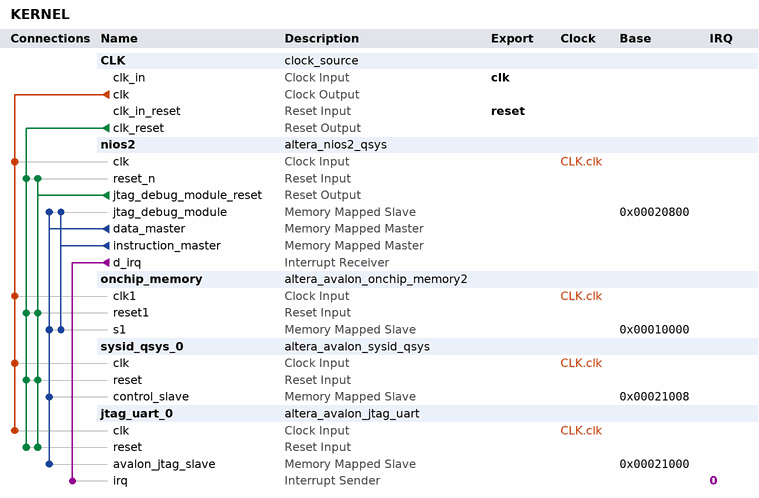
[diagram p0: system contents]
# Platform Designer (Qsys) system KERNEL, Cyclone IV E EP4CE15F17C8
# Parameters at their usual value, and those the tool derives, are not listed.
package require -exact qsys 12.1
create_system KERNEL
set_project_property DEVICE_FAMILY {Cyclone IV E}
set_project_property DEVICE EP4CE15F17C8

add_instance CLK clock_source 12.1
set_instance_parameter_value CLK clockFrequency 100000000

add_instance nios2 altera_nios2_qsys 12.1
set_instance_parameter_value nios2 resetSlave onchip_memory.s1
set_instance_parameter_value nios2 exceptionSlave onchip_memory.s1
set_instance_parameter_value nios2 breakSlave nios2.jtag_debug_module
set_instance_parameter_value nios2 impl Fast
set_instance_parameter_value nios2 icache_size 4096

add_instance onchip_memory altera_avalon_onchip_memory2 12.1
set_instance_parameter_value onchip_memory dataWidth 32
set_instance_parameter_value onchip_memory dualPort false
set_instance_parameter_value onchip_memory initMemContent true
set_instance_parameter_value onchip_memory initializationFileName onchip_memory
set_instance_parameter_value onchip_memory memorySize 40960

add_instance sysid_qsys_0 altera_avalon_sysid_qsys 12.1
set_instance_parameter_value sysid_qsys_0 id 0

add_instance jtag_uart_0 altera_avalon_jtag_uart 12.1
set_instance_parameter_value jtag_uart_0 simInteractiveOptions INTERACTIVE_ASCII_OUTPUT

# connections
add_connection CLK.clk jtag_uart_0.clk clock
add_connection CLK.clk nios2.clk clock
add_connection CLK.clk onchip_memory.clk1 clock
add_connection CLK.clk sysid_qsys_0.clk clock
add_connection CLK.clk_reset jtag_uart_0.reset reset
add_connection CLK.clk_reset nios2.reset_n reset
add_connection CLK.clk_reset onchip_memory.reset1 reset
add_connection CLK.clk_reset sysid_qsys_0.reset reset
add_connection nios2.jtag_debug_module_reset jtag_uart_0.reset reset
add_connection nios2.jtag_debug_module_reset nios2.reset_n reset
add_connection nios2.jtag_debug_module_reset onchip_memory.reset1 reset
add_connection nios2.jtag_debug_module_reset sysid_qsys_0.reset reset
add_connection nios2.data_master jtag_uart_0.avalon_jtag_slave avalon
set_connection_parameter_value nios2.data_master/jtag_uart_0.avalon_jtag_slave baseAddress 0x00021000
add_connection nios2.data_master nios2.jtag_debug_module avalon
set_connection_parameter_value nios2.data_master/nios2.jtag_debug_module baseAddress 0x00020800
add_connection nios2.data_master onchip_memory.s1 avalon
set_connection_parameter_value nios2.data_master/onchip_memory.s1 baseAddress 0x00010000
add_connection nios2.data_master sysid_qsys_0.control_slave avalon
set_connection_parameter_value nios2.data_master/sysid_qsys_0.control_slave baseAddress 0x00021008
add_connection nios2.instruction_master nios2.jtag_debug_module avalon
set_connection_parameter_value nios2.instruction_master/nios2.jtag_debug_module baseAddress 0x00020800
add_connection nios2.instruction_master onchip_memory.s1 avalon
set_connection_parameter_value nios2.instruction_master/onchip_memory.s1 baseAddress 0x00010000
add_connection nios2.d_irq jtag_uart_0.irq interrupt
set_connection_parameter_value nios2.d_irq/jtag_uart_0.irq irqNumber 0

# exported interfaces
add_interface clk clock sink
set_interface_property clk EXPORT_OF CLK.clk_in
add_interface reset reset sink
set_interface_property reset EXPORT_OF CLK.clk_in_reset

save_system KERNEL.qsys
